# EAGLE design 8RelaySwitchOrig (EAGLE 6.6.0)
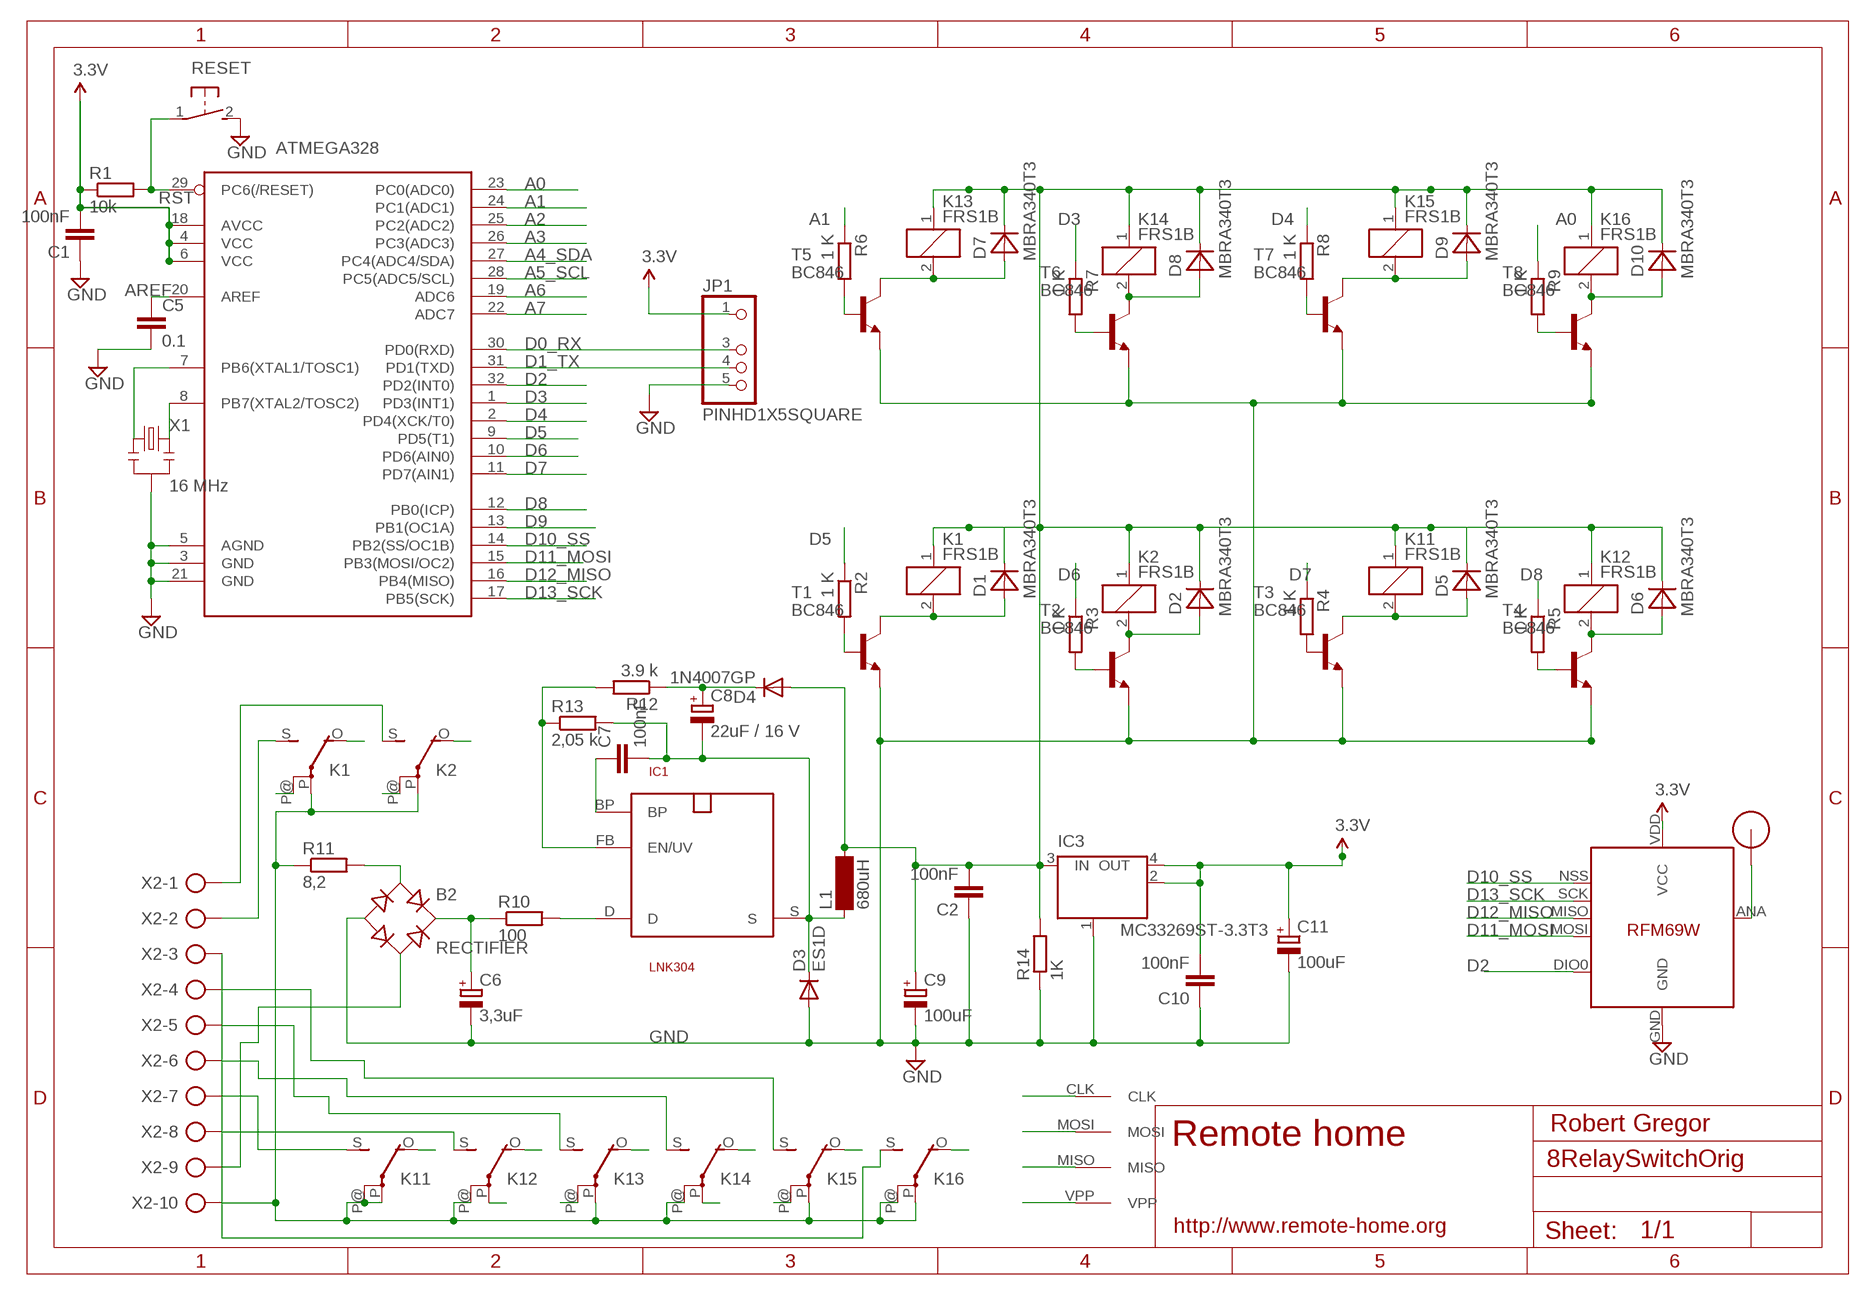
[diagram p0: schematic, sheet 1]

## Parts
ATMEGA328  ATMega-328  ATMEGA168/328TQFP32  [TQFP32-08]
B2  RECTIFIER  RECTIFIER-S40  [TO-269AA]
C1  100nF  C-EUC2012  [C2012]
C2  100nF  C-EUC2012  [C2012]
C5  0.1  C-EUC2012  [C2012]
C6  3,3uF  CPOL-EUE5-10.5  [E5-10,5]
C7  100nF  C-EUC2012  [C2012]
C8  22uF / 16 V  CPOL-EUSMCC  [SMC_C]
C9  100uF  CPOL-EUSMCB  [SMC_B]
C10  100nF  C-EUC2012  [C2012]
C11  100uF  CPOL-EUSMCB  [SMC_B]
D1  MBRA340T3  [SMA]
D2  MBRA340T3  [SMA]
D3  ES1D  DIODE-DO214AC  [DO214AC]
D4  1N4007GP  DIODE-DO214AA  [DO214AA]
D5  MBRA340T3  [SMA]
D6  MBRA340T3  [SMA]
D7  MBRA340T3  [SMA]
D8  MBRA340T3  [SMA]
D9  MBRA340T3  [SMA]
D10  MBRA340T3  [SMA]
IC1  LNK304  SO-8C  [SO-8C]
IC3  MC33269ST-3.3T3  [SOT223]
JP1  PINHD1X5SQUARE  [PINHD1X05-SQUARE]
K1  FRS1B  [FRS1B]
K2  FRS1B  [FRS1B]
K11  FRS1B  [FRS1B]
K12  FRS1B  [FRS1B]
K13  FRS1B  [FRS1B]
K14  FRS1B  [FRS1B]
K15  FRS1B  [FRS1B]
K16  FRS1B  [FRS1B]
L1  680uH  SD8  [SD8]
R1  10k  R-EU_R2012  [R2012]
R2  1 K  R-EU_M2012  [M2012]
R3  1 K  R-EU_M2012  [M2012]
R4  1 K  R-EU_M2012  [M2012]
R5  1 K  R-EU_M2012  [M2012]
R6  1 K  R-EU_M2012  [M2012]
R7  1 K  R-EU_M2012  [M2012]
R8  1 K  R-EU_M2012  [M2012]
R9  1 K  R-EU_M2012  [M2012]
R10  100  R-EU_R2512W  [R2512W]
R11  8,2  R-EU_0411/12  [0411/12]
R12  3.9 k  R-EU_M2012  [M2012]
R13  2,05 k  R-EU_M2012  [M2012]
R14  1K  R-EU_M2012  [M2012]
RESET  DTSM-3  [DTSM-3]
T1  BC846  [SOT23]
T2  BC846  [SOT23]
T3  BC846  [SOT23]
T4  BC846  [SOT23]
T5  BC846  [SOT23]
T6  BC846  [SOT23]
T7  BC846  [SOT23]
T8  BC846  [SOT23]
U$1  RFM12B_ANTENNA  [RFM12B-ANTENNA]
U$2  AVRHEADERDIP  [AVRHEADER]
U$5  RFM69  [RFM69W-MINPADS]
X1  16 MHz  RESONATORSMD  [RESONATOR-SMD]
X2  AK500/10  [AK500/10]

## Nets
5V1: C2.2 C9.+ D1.C D2.C D4.A D5.C D6.C D7.C D8.C D9.C D10.C IC3.3(IN) K1.1 K2.1 K11.1 K12.1 K13.1 K14.1 K15.1 K16.1 L1.2 R14.2
A0: ATMEGA328.23(PC0(ADC0)) R9.1
A1: ATMEGA328.24(PC1(ADC1)) R6.1
A2: ATMEGA328.25(PC2(ADC2))
A3: ATMEGA328.26(PC3(ADC3))
A4_SDA: ATMEGA328.27(PC4(ADC4/SDA))
A5_SCL: ATMEGA328.28(PC5(ADC5/SCL))
A6: ATMEGA328.19(ADC6)
A7: ATMEGA328.22(ADC7)
AREF: ATMEGA328.20(AREF) C5.1
D0_RX: ATMEGA328.30(PD0(RXD)) JP1.3
D1_TX: ATMEGA328.31(PD1(TXD)) JP1.4
D2: ATMEGA328.32(PD2(INT0)) U$5.DIO0
D3: ATMEGA328.1(PD3(INT1)) R7.1
D4: ATMEGA328.2(PD4(XCK/T0)) R8.1
D5: ATMEGA328.9(PD5(T1)) R2.1
D6: ATMEGA328.10(PD6(AIN0)) R3.1
D7: ATMEGA328.11(PD7(AIN1)) R4.1
D8: ATMEGA328.12(PB0(ICP)) R5.1
D9: ATMEGA328.13(PB1(OC1A))
D10_SS: ATMEGA328.14(PB2(SS/OC1B)) U$5.NSS(SEL)
D11_MOSI: ATMEGA328.15(PB3(MOSI/OC2)) U$2.MOSI U$5.MOSI
D12_MISO: ATMEGA328.16(PB4(MISO)) U$2.MISO U$5.MISO
D13_SCK: ATMEGA328.17(PB5(SCK)) U$2.CLK U$5.SCK
GND [power]: ATMEGA328.3(GND) ATMEGA328.5(AGND) ATMEGA328.21(GND) B2.- C1.1 C2.1 C5.2 C6.- C9.- C10.1 C11.- D3.A IC3.1(GND/ADJ) JP1.5 R14.1 RESET.2 T1.2(E) T2.2(E) T3.2(E) T4.2(E) T5.2(E) T6.2(E) T7.2(E) T8.2(E) U$5.GND X1.2
N$1: ATMEGA328.7(PB6(XTAL1/TOSC1)) X1.1
N$2: R2.2 T1.1(B)
N$3: U$1.P$1 U$5.ANA(ANT)
N$4: D2.A K2.2 T2.3(C)
N$5: D1.A K1.2 T1.3(C)
N$6: R3.2 T2.1(B)
N$7 [220V]: K1.S(2:S) X2.2
N$8 [220V]: K12.P(2:P)
N$9 [220V]: B2.AC2 X2.9
N$11 [220V]: K1.P@(2:P)
N$13 [220V]: IC1.D R10.2
N$14 [220V]: B2.+ C6.+ R10.1
N$15 [220V]: B2.AC1 R11.2
N$16 [220V]: K2.P@(2:P)
N$17 [220V]: K1.O(2:O)
N$18: C7.1 IC1.BP
N$19 [220V]: K2.O(2:O)
N$20: C8.+ D4.C R12.1
N$21: ATMEGA328.8(PB7(XTAL2/TOSC2)) X1.3
N$22: D5.A K11.2 T3.3(C)
N$24: R4.2 T3.1(B)
N$25: D6.A K12.2 T4.3(C)
N$26: R5.2 T4.1(B)
N$27: D7.A K13.2 T5.3(C)
N$28: R6.2 T5.1(B)
N$29: D8.A K14.2 T6.3(C)
N$30: R7.2 T6.1(B)
N$31: D9.A K15.2 T7.3(C)
N$32: R8.2 T7.1(B)
N$33: D10.A K16.2 T8.3(C)
N$34: R9.2 T8.1(B)
N$35 [220V]: K14.P(2:P)
N$36 [220V]: K12.S(2:S) X2.8
N$37 [220V]: K11.S(2:S) X2.7
N$38 [220V]: K13.P@(2:P)
N$40 [220V]: K15.P@(2:P)
N$41 [220V]: K1.P(2:P) K2.P(2:P) K11.P(2:P) K11.P@(2:P) K12.P@(2:P) K13.P(2:P) K14.P@(2:P) K15.P(2:P) K16.P(2:P) K16.P@(2:P) R11.1 X2.10
N$42 [220V]: K11.O(2:O)
N$43 [220V]: K12.O(2:O)
N$44 [220V]: K13.O(2:O)
N$45 [220V]: K14.O(2:O)
N$46 [220V]: K15.O(2:O)
N$47 [220V]: K16.S(2:S) X2.3
N$48 [220V]: K2.S(2:S) X2.1
N$50 [220V]: K13.S(2:S) X2.5
N$51 [220V]: K14.S(2:S) X2.6
N$52 [220V]: K15.S(2:S) X2.4
N$53 [220V]: K16.O(2:O)
RST: ATMEGA328.29(PC6(/RESET)) R1.2 RESET.1 U$2.VPP
S: C7.2 C8.- D3.C IC1.S L1.1 R13.2
VCC: ATMEGA328.4(VCC) ATMEGA328.6(VCC) ATMEGA328.18(AVCC) C1.2 C10.2 C11.+ IC3.2(OUT) IC3.4(OUT) JP1.1 R1.1 U$5.VDD(VCC) ; supply symbol labelled 3.3V
XXX: IC1.FB(EN/UV) R12.2 R13.1

## Notes on the sheet
- Robert Gregor
- Remote home
- http://www.remote-home.org

## Library data of the parts
ATMEGA328 = LowPowerLab:ATMEGA168/328: Atmel 32-pin 8-bit micro, 16k flash.
B2 = rectifier:RECTIFIER-: Rectifier
C1 C2 C5 C7 C10 = resistor:C-EU: CAPACITOR, European symbol
C6 C8 C9 C11 = resistor:CPOL-EU: POLARIZED CAPACITOR, European symbol
D1 D2 D5-D10 = diode:MBRA340T3: Surface Mount Schottky Power Rectifier Source: http://www.onsemi.com/pub_link/Collateral/MBRA340T3-D.PDF
D3 D4 = diode:DIODE-: DIODE
IC1 = powerint:SO-8C: 700V MOSFET für Schaltnetz-Trafos. Pin 3 fehlt. SMD
IC3 = linear:MC33269ST*: Adjustable Output Low Dropout Voltage Regulator 800 mA Source: http://www.onsemi.com/pub/Collateral/MC33269-D.PDF
JP1 = eagle-library-edeca.net-v5:PINHD1X5
K1 K2 K11-K16 = relay:FRS1B: RELAY 1 x switch, same as V23101-D6-A201, Siemens; OC_FARNELL: unknown; OC_NEWARK: unknown
L1 = inductor-neosid:SD8: INDUCTOR nominal inductance; OC_FARNELL: unknown; OC_NEWARK: unknown
R1-R14 = resistor:R-EU_: RESISTOR, European symbol
RESET = switch-tact:DTSM-3
T1-T8 = transistor:BC846: NPN TRANSISTOR
U$1 = LowPowerLab:RFM12B_ANTENNA
U$2 = RemoteHome:AVRHEADER
U$5 = LowPowerLab:RFM69
X1 = SparkFun:RESONATOR: Resonator Small SMD resonator. This is the itty bitty 10/20MHz resonators with built in caps. CSTCE10M0G55 and CSTCE20M0V53. Footprint has been reviewed closely but hasn't been tested yet.
X2 = con-ptr500:AK500/10: CONNECTOR; OC_FARNELL: unknown; OC_NEWARK: unknown

## Net classes
1 power: width 0.381 mm, clearance 0.254 mm
2 220V: width 0.381 mm, clearance 0.508 mm

## Board
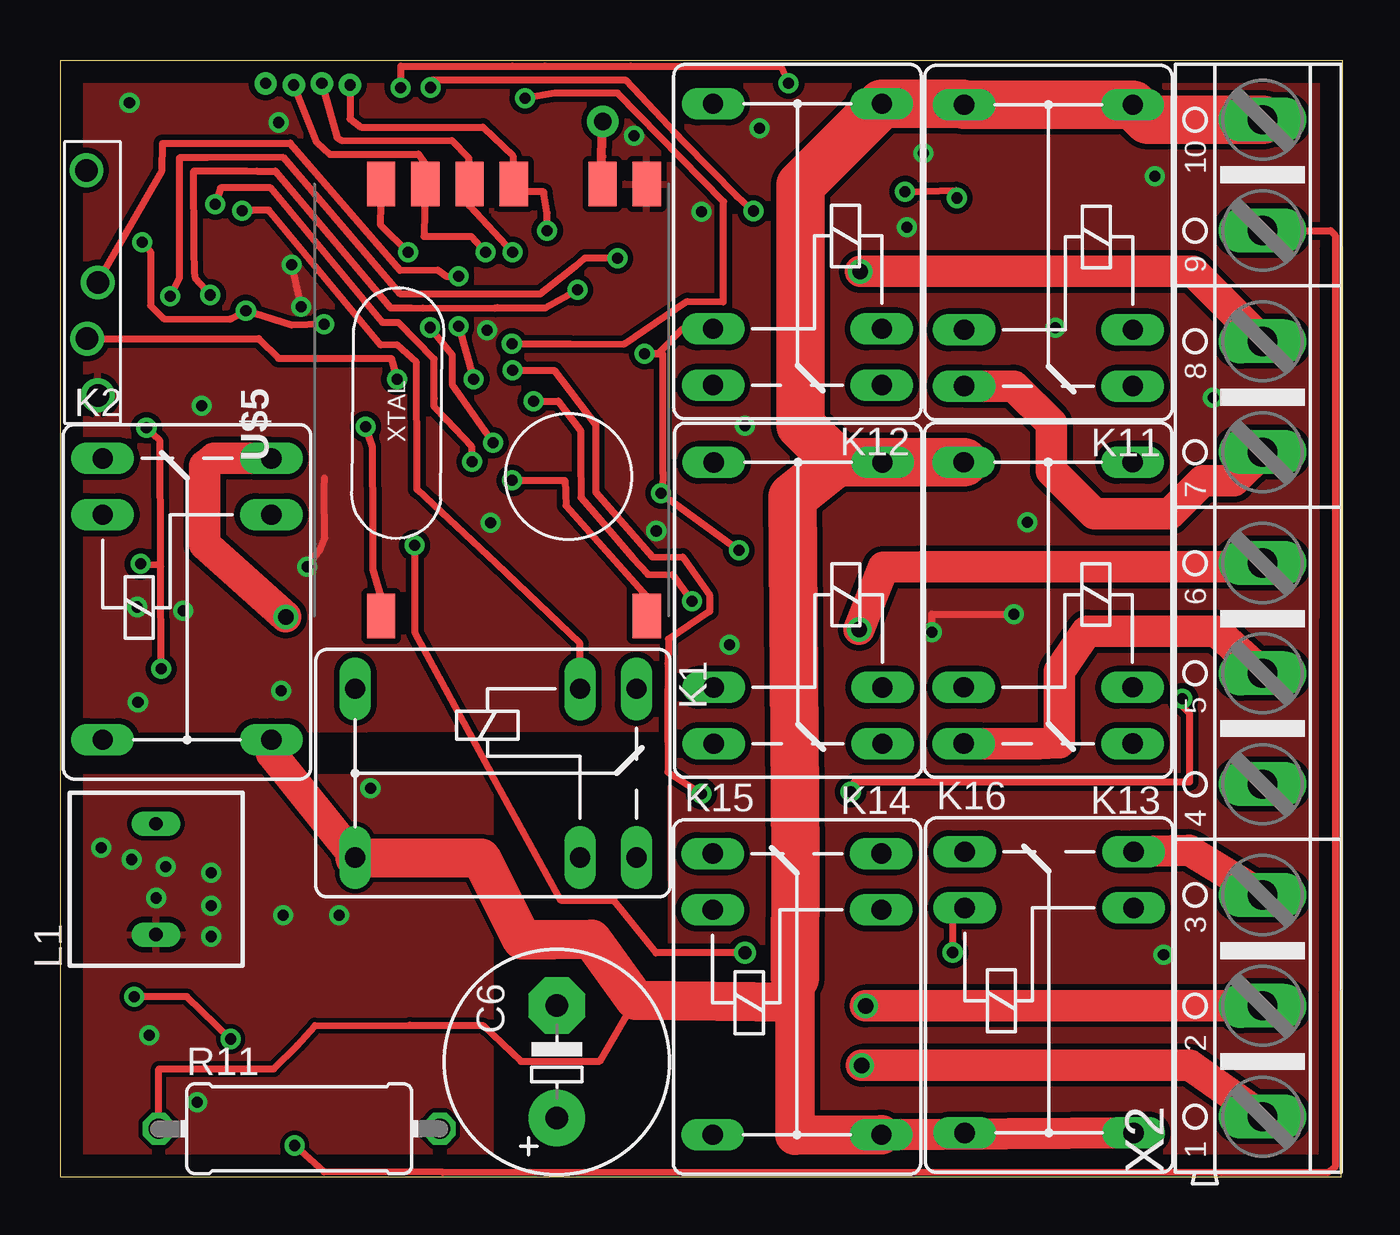
[diagram p1: board, top side]
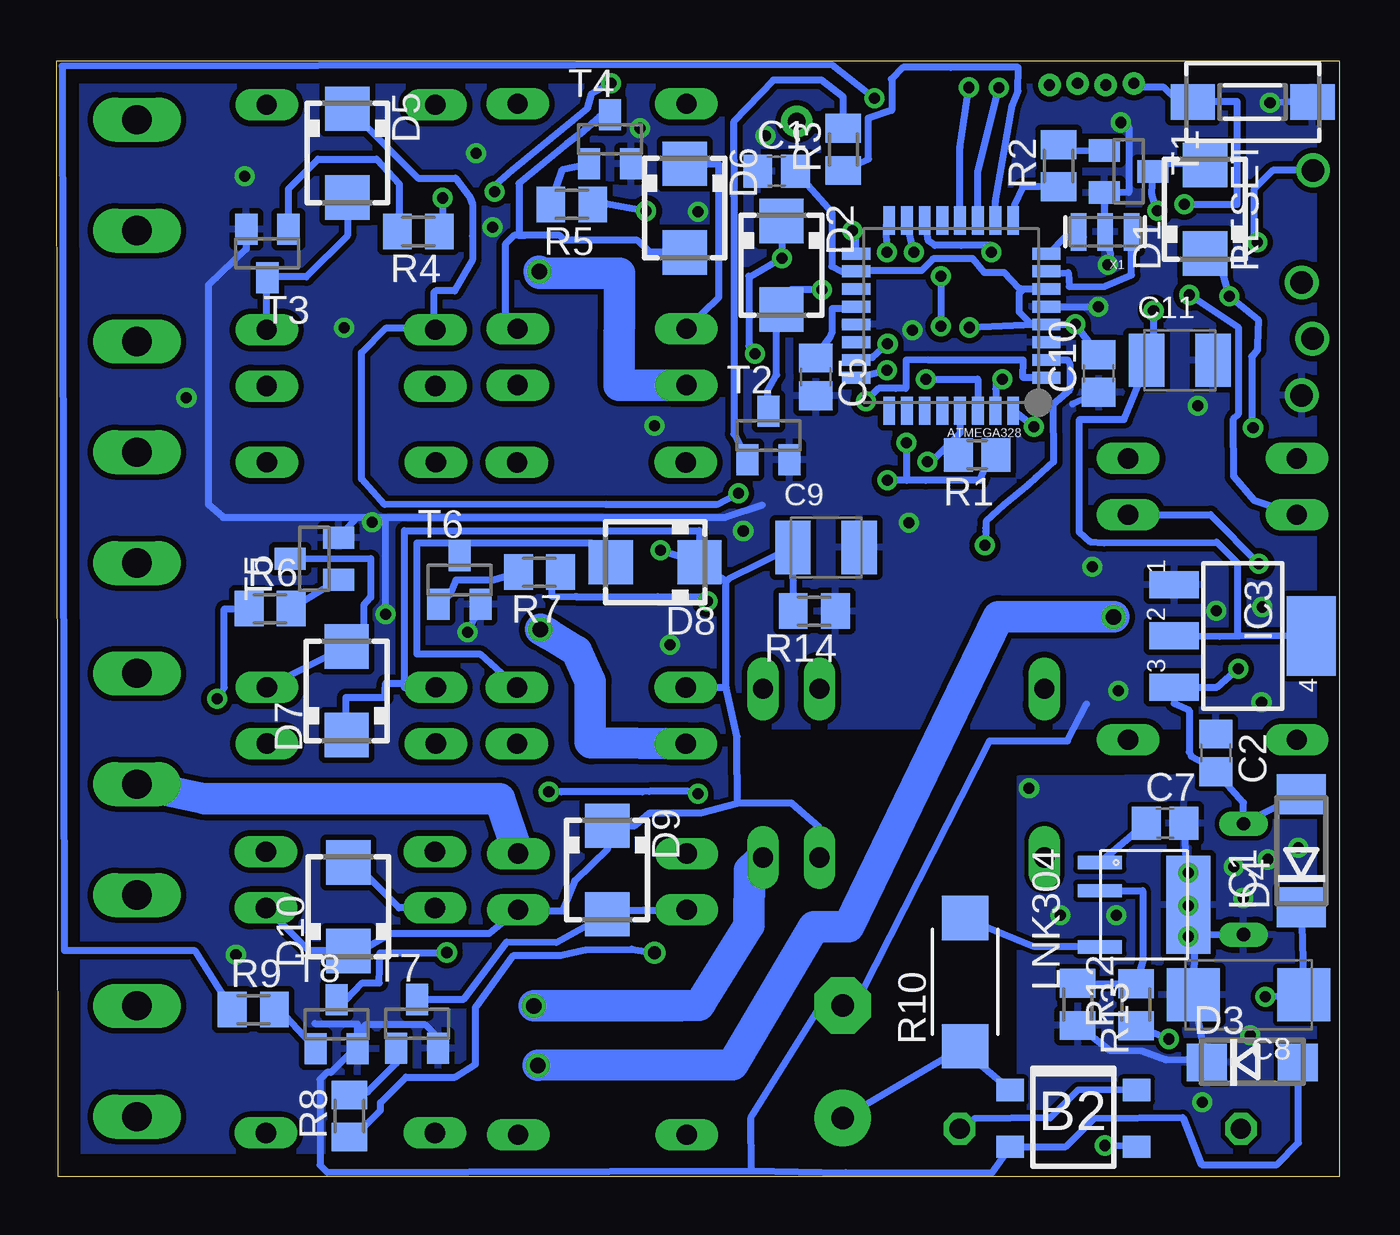
[diagram p2: board, bottom side, seen from below]

Size 57.9 x 50.4 mm. Coordinates in mm from the lower left corner, seen from the top.
Outline: 0,0 57.85,0 57.9,50.38 0,50.4 0,0
Copper layers (1*16): Top 0.035mm / dielectric 1.5mm / Bottom 0.035mm
Design rules "default": minimum track width 10mil, minimum drill 24mil, track to track 8mil, track to pad 8mil, pad to pad 8mil, via to via 8mil, smd to smd 8mil, copper to edge 40mil, drill to drill 8mil, minimum pad ring 10mil, minimum via ring 8mil, stop-mask expansion 4mil, vias tented up to drill 0mil, thermal gap 10mil

### Footprints (pad centres in the part's own frame; a part is rotated, then mirrored left to right if it is on the bottom)
TQFP32-08 = smd 1.27 x 0.533: 1 -4.293,2.8; 2 -4.293,2; 3 -4.293,1.2; 4 -4.293,0.4; 5 -4.293,-0.4; 6 -4.293,-1.2; 7 -4.293,-2; 8 -4.293,-2.8; 17 4.293,-2.8; 18 4.293,-2; 19 4.293,-1.2; 20 4.293,-0.4; 21 4.293,0.4; 22 4.293,1.2; 23 4.293,2; 24 4.293,2.8 | smd 0.533 x 1.27: 9 -2.8,-4.293; 10 -2,-4.293; 11 -1.2,-4.293; 12 -0.4,-4.293; 13 0.4,-4.293; 14 1.2,-4.293; 15 2,-4.293; 16 2.8,-4.293; 25 2.8,4.293; 26 2,4.293; 27 1.2,4.293; 28 0.4,4.293; 29 -0.4,4.293; 30 -1.2,4.293; 31 -2,4.293; 32 -2.8,4.293
TO-269AA = smd 1 x 1.25: + -1.28,-2.855; - 1.28,-2.855; AC1 -1.28,2.855; AC2 1.28,2.855
C2012 = smd 1.3 x 1.5: 1 -0.85,0; 2 0.85,0
E5-10,5 = drill 1.016 pad 2.54: + -2.54,0 | drill 1.016 pad 2.54 octagon: - 2.54,0
SMC_C = smd 2.4 x 2.4: + -2.5,0; - 2.5,0
SMC_B = smd 1.6 x 2.4: + -1.5,0; - 1.5,0
SMA = smd 2 x 2: A 2,0; C -2,0
DO214AC = smd 1.8 x 1.7: A 2.05,0; C -2.05,0
DO214AA = smd 1.8 x 2.2: A 2.55,0; C -2.55,0
SO-8C = smd 0.6 x 2: BP -1.905,-2; D 1.905,-2; FB -0.635,-2 | smd 4.41 x 2: S 0,2
SOT223 = smd 1.219 x 2.235: 1 -2.311,-3.099; 2 0,-3.099; 3 2.311,-3.099 | smd 3.6 x 2.2: 4 0,3.099
PINHD1X05-SQUARE = drill 1.016: 1 -5.061,-0.269; 3 0,0.24; 4 2.54,-0.24; 5 5.099,0.24
FRS1B = drill 0.914 long: 1 0,3.81; 2 0,-3.81; O -2.54,-3.81; P 10.16,3.81; P@ 10.16,-3.81; S -2.54,3.81
SD8 = drill 0.6 long: 1 -2.5,0; 2 2.5,0
R2012 = smd 1.3 x 1.5: 1 -0.85,0; 2 0.85,0
M2012 = smd 1.3 x 1.6: 1 -0.95,0; 2 0.95,0
R2512W = smd 2 x 2.1: 1 -2.896,0; 2 2.896,0
0411/12 = drill 0.914 octagon: 1 -6.35,0; 2 6.35,0
DTSM-3 = smd 2 x 1.6: 1 -2.7,0; 2 2.7,0
SOT23 = smd 1 x 1.4: 1 -0.95,-1.1; 2 0.95,-1.1; 3 0,1.1
RFM12B-ANTENNA = drill 0.8 pad 1.422: P$1 0,0
AVRHEADER = drill 0.5: CLK 2.54,0; MISO 1.27,0.07; MOSI 0,0; VPP -1.27,0.072
RFM69W-MINPADS = smd 2 x 1.27: ANA 8,-5; DIO0 -11.5,5; GND 8,-7; MISO 8,1; MOSI 8,3; NSS 8,5; SCK 8,-1; VDD -11.5,-7
RESONATOR-SMD = smd 0.7 x 1.7: 1 -1.2,0; 2 0,0; 3 1.2,0
AK500/10 = drill 1.321 long: 1 -22.504,0; 2 -17.501,0; 3 -12.497,0; 4 -7.493,0; 5 -2.489,0; 6 2.489,0; 7 7.493,0; 8 12.497,0; 9 17.501,0; 10 22.504,0

### Placement (x,y rotation side)
ATMEGA328  17.52,38.88 180 bottom
B2  11.99,2.64 270 bottom
C1  25.41,45.4 0 bottom
C2  5.57,19.14 270 bottom
C5  23.63,36.11 270 bottom
C6  22.42,5.19 90 top
C7  7.86,15.96 0 bottom
C8  4.09,8.22 180 bottom
C9  23.16,28.41 0 bottom
C10  10.86,36.27 90 bottom
C11  7.19,36.86 0 bottom
D1  6.06,43.68 90 bottom
D2  25.18,41.15 270 bottom
D3  3.91,5.16 0 bottom
D4  1.7,14.72 90 bottom
D5  44.79,46.22 270 bottom
D6  29.55,43.73 270 bottom
D7  44.82,21.94 90 bottom
D8  30.89,27.75 180 bottom
D9  33.05,13.85 270 bottom
D10  44.74,12.19 90 bottom
IC1  8.8,12.28 270 bottom
IC3  4.35,24.42 270 bottom
JP1  1.44,40.38 270 top
K1  23.47,18.22 180 top
K2  5.71,29.89 270 top
K11  44.62,38.24 90 top
K12  33.29,38.28 90 top
K13  44.61,22.1 90 top
K14  33.32,22.09 90 top
K15  33.27,12.05 270 top
K16  44.65,12.14 270 top
L1  4.32,13.44 90 top
R1  16.34,32.59 180 bottom
R2  12.67,45.64 90 bottom
R3  22.39,46.38 90 bottom
R4  41.58,42.68 180 bottom
R5  34.65,43.91 180 bottom
R6  48.28,25.65 0 bottom
R7  36.11,27.3 180 bottom
R8  44.69,2.74 90 bottom
R9  49.03,7.55 0 bottom
R10  16.89,8.79 90 bottom
R11  10.78,2.17 0 top
R12  9.17,7.77 90 bottom
R13  11.8,7.78 270 bottom
R14  23.7,25.53 180 bottom
RESET  3.9,48.52 0 bottom
T1  9.51,45.39 270 bottom
T2  25.77,33.46 0 bottom
T3  48.4,41.69 180 bottom
T4  32.92,46.84 0 bottom
T5  46.28,27.9 90 bottom
T6  39.73,26.94 0 bottom
T7  41.63,6.9 0 bottom
T8  45.28,6.89 0 bottom
U$1  24.49,47.64 0 top
U$2  10.54,49.29 0 top
U$5  19.48,36.82 90 top
X1  10.57,42.66 180 bottom
X2  54.29,25.22 90 top

### Tracks (layer width: path | path; a pad name or v marks a point on that pad's centre or on a via)
5V1  (via drill 0.5)
  Top 0.305: v25.16,41.47 23.68,41.47 23.24,41.08 21.67,39.85 21.27,39.84 15.35,39.84 10.06,46.02 6.65,46.02 5.36,46 5.37,40.58 v4.96,39.75 | K12.1 28.1,38.28 26.98,37.17 v26.39,37.17 27.17,37.17 27.2,37.14 27.2,31.88 27.21,31.77 27.18,31.06 v27.12,30.87 v30.64,28.28 | v4.55,22.94 4.52,27.49 | 4.52,27.49 4.52,27.98 4.5,33.23 v3.88,33.82 | v3.62,27.67 4.49,27.64 4.52,27.49
  Bottom 0.305: v26.39,37.17 26.65,37.5 26.65,40.66 26.63,40.62 v25.16,41.47 25.14,43.7 D2.C | D6.C 28.02,45.72 28.02,43.31 28.02,39.7 K12.1 | D5.C 44.68,48.17 41.6,45.09 39.91,45.09 39.24,44.2 39.13,43.92 39.13,42.47 39.13,41.4 39.94,40 40.79,40 40.88,39.91 40.88,38.31 K11.1 40.89,38.32 43.03,38.32 44.14,37.2 44.14,31.51 43.1,30.35 33.1,30.36 33.1,30.35 28.12,30.35 v27.12,30.87 | 27.68,22.09 27.68,26.87 | 27.68,26.87 27.89,27.02 | 27.89,27.02 28.89,27.72 D8.C | K13.1 42.2,22.1 42.2,22.29 | 42.2,22.29 42.2,29.17 28.89,29.17 D8.C | D7.C 44.85,21.65 43.1,21.65 43.05,22.29 42.2,22.29 | K16.1 46.52,10.19 D10.C 44.17,10.19 42.8,10.98 38.37,10.98 K15.1 37.02,12 34.95,12 35.04,12.03 34.51,13.37 33.05,14.78 33.05,14.96 D9.C 31.8,15.85 31.12,16.43 28.82,16.43 27.18,16.86 | K14.1 27.68,22.09 | 27.68,22.09 27.18,19.87 27.18,18.15 27.18,16.86 | v30.64,28.28 D8.C | 24.71,16.87 27.18,16.86 | 27.86,26.99 27.89,27.02 | 25.91,16.88 24.71,16.87 | K1.1 23.47,15.78 24.71,16.87 | D1.C 5.28,40.9 v4.96,39.75 3.65,38.7 3.69,37.55 3.69,37.33 3.94,37.02 3.94,34.11 3.94,33.9 v3.88,33.82 | 27.68,26.87 27.55,26.99 C9.+ R14.2 | D4.A L1.2 4.32,16.89 C2.2 6.09,18.67 6.67,18.99 6.76,19.17 6.76,21.06 7.45,21.36 IC3.3 5.51,22.1 v4.55,22.94 | K2.1 5.81,29.89 v3.62,27.67
A0  (via drill 0.5)
  Top 0.305: v20.39,37.6 23.02,37.6 25.45,37.59 28.3,39.52 29.94,39.5 29.94,40.53 29.94,42.46 29.95,44.03 25.16,48.92 22.32,48.92 v20.99,48.69
  Bottom 0.305: ATMEGA328.23 21.07,37 v20.39,37.6 | v20.99,48.69 22.9,50.2 57.67,50.15 57.57,10.22 51.68,10.22 R9.1
A1  (via drill 0.5)
  Top 0.305: v20.42,36.42 22.3,36.41 24.18,33.96 24.17,30.92 26.73,27.98 28.11,27.98 29.31,26.28 29.32,25.52 27.45,24.28 27.45,23.72 27.44,23.49 27.43,23.18 27.43,20.92 27.43,18.27 v28.95,17.29 | v35.69,17.39 35.85,17.83 51,17.83 51,20.91 50.67,21.25 v50.67,21.58
  Bottom 0.305: ATMEGA328.24 v20.42,36.42 | v28.95,17.29 29.4,17.4 31.15,17.4 31.47,17.38 35.12,17.38 v35.69,17.39 | R6.1 50.34,25.64 50.34,22.09 50.6,21.54 v50.67,21.58
AREF
  Bottom 0.305: C5.1 24,37.33 24.01,37.34 23.8,36.78 23.02,37.85 22.89,38.16 22.88,39.21 21.88,39.21 ATMEGA328.20
D0_RX  (via drill 0.5)
  Top 0.305: v17.98,40.65 17.43,40.65 17.04,40.94 15.33,40.92 10.38,46.66 4.61,46.66 4.59,45.43 JP1.3 | v17.98,38.39 v18.66,36.02
  Bottom 0.305: v17.98,40.65 v17.98,38.39 | v18.66,36.02 16.32,36.01 ATMEGA328.30
D1_TX  (via drill 0.5)
  Top 0.305: v15.2,36.01 14.94,36.95 9.85,36.95 8.96,37.84 JP1.4
  Bottom 0.305: v15.2,36.01 15.5,36 15.51,35.56 15.51,34.6 ATMEGA328.31
D2  (via drill 0.5)
  Top 0.305: U$5.DIO0 14.45,26.34 14.11,27.43 14.11,30.24 14.09,32.03 14.09,32.95 v13.78,33.86
  Bottom 0.305: v13.78,33.86 14.71,34.58 ATMEGA328.32
D3  (via drill 0.5)
  Top 0.305: v21.36,35.02 22.48,35.02 23.49,33.68 23.5,32.51 23.5,30.66 24.4,29.64 25.85,27.93 26.53,27.2 27.66,27.19 v28.52,25.98
  Bottom 0.305: ATMEGA328.1 14.28,36.08 14.27,36.87 18.27,36.87 18.53,36.87 18.57,36.88 19.55,36.87 19.57,35.59 20.02,35.59 20.8,35.59 v21.36,35.02 | v28.52,25.98 28.71,26.2 30.77,26.19 34.42,26.19 34.49,26.19 35.57,26.22 35.57,27.26 R7.1
D4  (via drill 0.5, 0.6)
  Top 0.305: v16,28.51 16,26.04 16,24.57 19.45,18.22 22.62,12.47 25,12.47 26.89,10.11 v30.91,10.12
  Bottom 0.305: R8.1 44.49,1.79 43.29,3 43.29,3.35 42.14,4.5 39.93,4.5 39.01,5.07 39.01,7.63 37.28,10 35.16,10 34.03,10.24 31.95,10.28 v30.91,10.12 | ATMEGA328.2 12.27,36.88 12.16,36.72 12.16,35.54 12.93,34.87 12.9,32.28 13.7,31.57 14.02,31.27 15.12,30.35 15.95,29.59 15.95,29.3 15.95,29.14 v16,28.51
D5
  Bottom 0.305: R2.1 13.88,44.7 14.29,44.7 14.66,43.89 ATMEGA328.9
D6
  Bottom 0.305: ATMEGA328.10 15.52,44.02 14.75,48.39 14.49,49.01 14.49,50.09 17.53,50.09 19.69,50.09 20.22,49.56 20.2,49.56 20.2,48.15 21.26,47.79 21.25,45.94 R3.1
D7  (via drill 0.5)
  Top 0.305: v15.35,49.17 15.38,49.35 15.38,50.14 20.41,50.14 21.87,50.15 25.76,50.15 27.76,50.13 32.53,50.13 v32.88,49.37 | v38.15,44.48 40.46,44.53 v40.48,44.19
  Bottom 0.305: ATMEGA328.11 16.32,45.4 v15.35,49.17 | v32.88,49.37 33.77,48.88 33.97,48.22 37.36,45.44 38.13,44.77 v38.15,44.48 | v40.48,44.19 40.48,43.2 R4.1
D8  (via drill 0.5)
  Top 0.305: v16.72,49.18 16.75,49.33 16.8,49.52 25.52,49.52 28.11,46.76 30.55,44.26 v31.29,43.6
  Bottom 0.305: ATMEGA328.12 17.12,46.47 v16.72,49.18 | v31.29,43.6 33.18,43.93 R5.1
D10_SS  (via drill 0.5)
  Top 0.305: U$5.NSS 14.45,42.98 v15.7,41.74
  Bottom 0.305: v15.7,41.74 15.74,42.07 17.07,42.05 18.25,42.05 18.55,42.27 18.7,43.16 ATMEGA328.14
D11_MOSI  (via drill 0.5)
  Top 0.305: v19.2,41.73 18.55,42.46 16.42,42.45 U$5.MOSI 16.46,44.48 16.46,45.73 16.16,46.17 12.17,46.16 11.57,46.71 U$2.MOSI
  Bottom 0.305: v19.2,41.73 19.54,43.15 ATMEGA328.15
D12_MISO  (via drill 0.5)
  Top 0.305: v20.42,41.73 18.45,43.85 U$5.MISO 18.43,44.48 18.43,46 17.67,46.8 12.72,46.78 12.49,46.92 U$2.MISO
  Bottom 0.305: v20.42,41.73 20.44,43.01 ATMEGA328.16
D13_SCK  (via drill 0.5)
  Top 0.305: v21.98,42.72 21.98,43.51 21.82,44.47 20.45,44.47 U$5.SCK 20.44,44.47 20.44,46.09 19.08,47.38 13.57,47.38 13.08,47.76 U$2.CLK
  Bottom 0.305: ATMEGA328.17 21.81,42.84 v21.98,42.72
GND  (via drill 0.5)
  Top 0.305: v11.13,27.54 11.7,28.28 11.93,28.85 11.9,31.06 11.93,31.56 | v10.44,41.18 10.63,40.32 v10.87,39.28 | v39.35,24.59 39.35,25.4 v43.06,25.4
  Bottom 0.305: 10.58,44.26 X1.2 10.33,41.65 v10.44,41.18 | 26.04,30.33 27.68,29.79 27.77,29.77 43.05,29.77 | 13.21,37.66 ATMEGA328.3 | T3.2 49.35,41.9 51.07,40.26 51.07,30.36 50.4,29.77 44.35,29.77 | 44.35,29.77 43.05,29.77 | T6.2 v39.35,24.59 | v43.06,25.4 43.05,29.77 | T5.2 44.35,29.77 | T7.2 40.68,6.28 41.26,6.86 43.96,6.86 | 43.96,6.86 44.33,6.49 | 44.33,6.49 T8.2 | 43.96,6.86 43.97,6.86 43.97,6.27 45.52,4.71 45.7,4.71 46.02,4.39 46.02,0.53 45.7,0.21 26.57,0.26 | 26.57,0.26 22.28,0.19 15.67,0.19 B2.- 12.34,1.36 11.06,2.64 7.06,2.68 6.21,0.55 2.81,0.55 1.83,1.53 1.83,5.13 D3.A | RESET.2 1.78,48.52 v3.12,48.5 | v9.86,47.6 9.5,47.39 9.5,44.45 T1.2 | 44.33,6.49 44.33,6.89 46.21,6.89 46.26,6.92 | ATMEGA328.5 10.62,39.28 v10.87,39.28 10.96,39.19 | 26.57,0.26 26.58,2.66 23.42,7.73 C6.- 21.97,7.73 21.55,8.33 15.77,19.68 12.26,19.68 11.41,21.34 | C10.1 12.02,34.9
  other vias: 49.43,45.18 44.93,38.34 52.06,35.16 49.82,10.03 25.9,47 6.38,34.82 43.68,29.56 31.56,47.34 26.91,29.15 30.22,24.03 19.43,29.53 3.47,25.72 3.5,21.43 5.53,25.55 28.96,43.58 38.22,42.87 38.97,46.22 30.92,33.91 19.27,38.22 9.96,21.95
  pour Top: 27,50.17 0.15,50.23 0.2,46.62 0.17,20.2 27.54,20.25 27.62,1.79 27.61,1.33 27.63,0.17 29.57,0.17 57.68,0.19 57.73,50.13 32.49,50.19
  pour Bottom: 25.19,50.18 0.2,50.21 0.2,20.33 27.61,20.33 27.61,0.2 57.67,0.2 57.76,42.84 57.76,50.19
N$1
  Bottom 0.305: ATMEGA328.7 13.22,40.84 13.18,40.79 12.23,40.82 12.18,40.19 10.54,40.21 9.38,40.71 9.38,42.19 X1.1
N$2
  Bottom 0.305: R2.2 12.3,46.31 T1.1
N$3
  Top 0.406: U$5.ANA 24.45,46.06 U$1.P$1
N$4  (via drill 0.5)
  Top 0.305: v6.77,39.81 6.1,40.55 6.06,40.82 6.03,41.89 6.02,45.42 8.43,45.41 8.88,45.41 9.71,45.41 14.91,39.23 15.71,39.23 15.86,39.23 16.37,39.22 16.7,39.23 19.62,39.22 19.73,39.23 21.89,39.23 v23.34,40.04
  Bottom 0.305: T2.3 25.8,35.51 25.41,36.2 25.41,38.67 25.75,39.33 25.11,39.33 D2.A 25.09,39.35 25.44,39.44 24.78,40.04 v23.34,40.04 | K2.2 3.83,30.53 4.76,31.61 4.77,34.22 4.53,34.45 4.53,34.7 4.53,38.33 v6.77,39.81
N$5  (via drill 0.5)
  Top 0.305: v8.2,43.61 8.68,43.63 9.4,43.64 14.47,37.54 15.21,37.55 16.08,36.77 16.1,31.48 16.1,31.03 19.7,27.68 23.46,24.08 K1.2
  Bottom 0.305: v8.2,43.61 8.45,44.35 T1.3 7.73,45.73 D1.A
N$6
  Bottom 0.305: T2.1 27.34,33.54 27.34,44.28 27.34,47.62 25.55,49.51 23.37,49.51 22.39,48.75 R3.2
N$7  (via drill 0.7)
  Top 1.422: X2.2 v36.36,7.72
  Bottom 1.422: v36.36,7.72 29.73,7.72 28.9,7.75 28.82,7.87 26.64,11.35 26.63,13.84 K1.S
N$9  (via drill 0.5)
  Top 0.305: X2.9 57.37,42.72 57.57,42.52 57.57,0.45 57.23,0.19 52.41,0.19 17.28,0.2 11.91,0.22 v10.58,1.41
  Bottom 0.305: B2.AC2 v10.58,1.41
N$13
  Bottom 0.305: IC1.D 13.75,10.39 R10.2
N$14
  Bottom 0.305: B2.+ 16.13,5.02 R10.1 C6.+
N$15
  Bottom 0.305: B2.AC1 11.78,3.92 13.04,2.66 13.19,2.66 16.45,2.63 R11.2
N$18
  Bottom 0.305: IC1.BP C7.1
N$20  (via drill 0.5)
  Top 0.305: v7.69,6.22 5.71,8.13 v3.33,8.12
  Bottom 0.305: D4.C C8.+ v3.33,8.12 | R12.1 v7.69,6.22
N$21
  Bottom 0.305: ATMEGA328.8 13.11,41.68 12.35,42.44 11.53,42.44 X1.3
N$22
  Bottom 0.305: K11.2 48.43,40.56 T3.3 48.36,40.63 46.65,40.63 44.79,42.49 D5.A
N$24
  Bottom 0.305: T3.1 47.45,44.6 46.11,45.94 43.47,45.94 42.45,44.82 42.45,43.18 R4.2
N$25
  Bottom 0.305: D6.A 31.13,41.73 31.67,42.28 34.98,42.28 35.2,42.5 36.77,42.5 | 36.77,42.5 37.26,42.5 37.66,42.1 37.66,38.85 K12.2 | T4.3 33.4,47.86 34.31,47.08 34.88,46.64 37.03,44.85 37.03,42.5 36.77,42.5
N$26
  Bottom 0.305: R5.2 35.06,45.48 T4.1
N$27
  Bottom 0.305: T5.3 43.74,27.92 43.74,26.16 44.05,25.81 44.05,23.69 D7.A K13.2
N$28
  Bottom 0.305: T5.1 R6.2
N$29
  Bottom 0.305: D8.A 33.38,27.33 33.74,27.33 33.74,28.6 40.16,28.6 | 40.16,28.6 41.65,28.6 41.65,23.61 38.8,23.61 K14.2 | T6.3 40.08,28.52 40.16,28.6
N$30
  Bottom 0.305: T6.1 41.03,25.39 40.14,26.3 | 40.14,26.3 | 40.14,26.3 39.88,26.95 38.18,26.95 R7.2
N$31
  Bottom 0.305: K15.2 31.42,12.04 33.07,12.03 D9.A 35.34,10.59 37.58,10.6 39.52,8.02 T7.3
N$32
  Bottom 0.305: T7.1 42.58,5.12 43.86,3.84 44.55,3.84 R8.2
N$33  (via drill 0.5)
  Top 0.305: v40.3,10.13 40.3,11.59 K16.2
  Bottom 0.305: K16.2 42.46,12.14 44.08,13.76 44.31,13.76 D10.A | v40.3,10.13 43.31,10.11 43.34,8.76 44.11,8.76 44.85,7.99 T8.3
N$34
  Bottom 0.305: R9.2 47.84,7.55 T8.1
N$36  (via drill 0.7)
  Top 1.422: v36.13,40.87 51.13,40.87 X2.8
  Bottom 1.422: K12.S 32.51,35.74 32.49,40.79 36.1,40.79 v36.13,40.87
N$37
  Top 1.422: K11.S 43.06,35.7 44.74,34.01 44.74,31.88 46.69,29.93 50.11,29.93 51.6,31.42 53,31.42 X2.7
N$41
  Top 0.305: K16.P@ K15.P | R11.1 4.44,4.87 9.63,4.87 10.68,5.92 11.49,6.83 15.77,6.84 19.09,6.84 20.8,5.21 20.81,5.22 24.36,5.22 25.98,7.97
  Top 1.422: K2.P 9.53,19.09 K1.P | K16.P K15.P | 33.17,7.88 33.18,9
  Top 1.778: K1.P 19,14.39 20.84,10.71 22.22,10.7 23.99,10.72 25.98,7.97 33.17,7.88 | 33.18,9 33.17,5.96 33.18,1.87 K15.P
  Top 2.184: X2.10 49.11,47.72 K11.P@ K11.P 40.77,48.44 K12.P@ 33.42,44.77 33.42,33.94 35.1,32.26 | K13.P K14.P@ | K13.P 35.1,32.26 | K13.P 35.1,32.26 | 35.1,32.26 35.08,32.29 | 35.08,32.29 | 35.08,32.29 33.07,30.68 33.2,14.47 33.18,9
N$47
  Top 1.422: X2.3 50.97,14.73 K16.S
N$48  (via drill 0.7)
  Top 1.422: K2.S 6.93,32.43 6.51,32.1 6.51,28.55 v10.18,25.28 | X2.1 51.01,5.03 v36.18,5.03
  Bottom 1.422: v36.18,5.03 27.4,5.05 23.71,11.28 22.17,11.29 15.39,25.29 v10.18,25.28
N$50
  Top 1.422: K13.S 44.19,19.56 45.12,19.61 45.12,22.83 46.34,24.6 46.37,24.64 52.2,24.64 X2.5
N$51  (via drill 0.7)
  Top 1.422: v36.07,24.71 37.16,27.52 38.91,27.54 54.12,27.54 X2.6
  Bottom 1.422: K14.S 33.78,19.59 33.83,19.63 33.83,22.38 34.44,23.73 35.69,24.5 v36.07,24.71
N$52
  Bottom 1.422: X2.4 51.23,17.07 37.9,17.07 K15.S
RST  (via drill 0.5)
  Top 0.305: v18.59,32.28 18.59,32.96 17.44,34.17 16.88,34.76 16.88,35.14 16.88,36.91 15.27,38.56 14.55,38.56 9.5,44.64 7.23,44.64 v6.99,43.9
  Bottom 0.305: 17.12,33.57 ATMEGA328.29 17.12,33.57 | 17.12,33.57 17.42,33.27 17.42,32.51 R1.2 | U$2.VPP 9.2,49.19 7.91,49.19 7.24,48.52 RESET.1 4.6,48.54 4.6,43.9 v6.99,43.9 | 17.12,33.57 18.32,32.37 18.62,32.37 v18.59,32.28
S  (via drill 0.5)
  Bottom 0.305: L1.1 6.47,10.9 | 6.47,10.9 IC1.S C7.2 | 6.47,10.9 C8.- D3.C 6.84,5.31 7.8,5.29 8.91,5.68 10.35,5.71 R13.2
  other vias: 6.17,3.37 4,6.38 1.84,14.86 3.22,14.32 14,17.55 6.8,13.72 6.8,12.23 6.8,10.85 4.32,12.59 4.75,14.01 10.06,11.81 12.58,11.81
  pour Bottom: 0.18,18.05 14.42,17.98 14.42,0.18 0.14,0.18 0.14,17.94
  pour Top: 14.46,18.01 0.14,18.05 0.18,0.11 19.42,0.11 19.42,18.05 14.49,17.98
VCC  (via drill 0.5)
  Top 0.305: 26.44,25.75 U$5.VDD 26.48,26.21 22.83,30.3 22.78,31.44 22.55,31.44 v20.4,31.44 | v16.7,38.34 17.69,37.1 17.7,35.76 v19.54,33.14 | v3.7,42.19 4.07,41.75 4.07,39.34 4.65,38.75 7.66,38.72 v8.38,39.1 10.45,38.45 v11.91,38.49
  Bottom 0.305: IC3.4 4.51,24.41 | 4.51,24.41 5.39,24.39 IC3.2 | ATMEGA328.6 14.26,40.08 | 14.26,40.08 14.45,40.12 15.12,40.82 16.02,40.82 16.54,41.46 18.3,41.46 18.32,41.44 18.34,41.44 18.85,40.91 21.79,40.9 ATMEGA328.18 22.47,40.87 22.91,41.1 22.91,43.55 C1.2 | ATMEGA328.4 13.89,38.48 14.45,39.03 14.45,39.89 14.26,40.08 | R1.1 15.82,32.47 16.21,31.44 18.67,31.44 19.53,31.44 | 19.53,31.44 v20.4,31.44 | ATMEGA328.4 v16.7,38.34 | v19.54,33.14 19.54,31.45 19.53,31.44 | JP1.1 2.98,45.44 3.85,44.58 3.85,42.3 v3.7,42.19 | ATMEGA328.4 11.79,38.48 v11.91,38.49 C10.2 | v8.38,39.1 8.4,37.46 C11.+ 8.72,36.63 9.71,34.19 11.72,34.19 11.74,29.11 11.25,28.68 10.61,28.62 5.53,28.65 4.59,27.72 4.59,24.48 4.51,24.41
XXX
  Bottom 0.305: IC1.FB 8.86,12.91 8.86,9.76 R12.2 R13.1